# EAGLE design v1 (EAGLE 7.6.0)
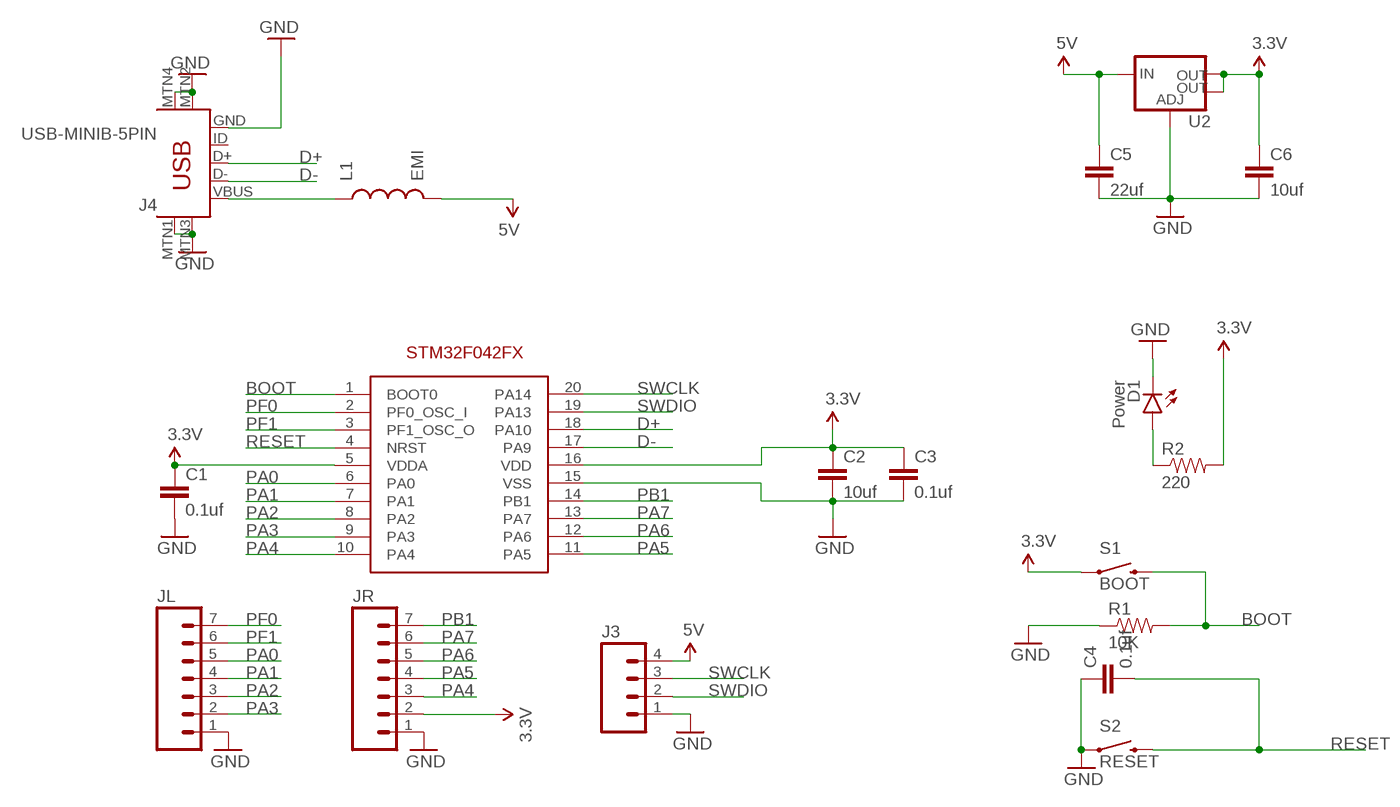
[diagram p0: schematic, sheet 1]

## Parts
C1  0.1uf  CAP0805  [0805]
C2  10uf  CAP0805  [0805]
C3  0.1uf  CAP0805  [0805]
C4  0.1uf  CAP0805  [0805]
C5  22uf  CAP0805  [0805]
C6  10uf  CAP0805  [0805]
D1  Power  LED1206  [LED-1206]
J3  M04NO_SILK_ALL_ROUND  [1X04_NO_SILK_ALL_ROUND]
J4  USB-MINIB-5PIN  [USB-MINIB]
JL  M07NO_SILK  [1X07_NO_SILK]
JR  M07NO_SILK  [1X07_NO_SILK]
L1  EMI  INDUCTOR0805  [0805]
R1  10K  RESISTOR0805-RES  [0805]
R2  220  RESISTOR0805-RES  [0805]
S1  BOOT  SWITCH-MOMENTARY-2SMD-1101NE  [TACTILE-SWITCH-1101NE]
S2  RESET  SWITCH-MOMENTARY-2SMD-1101NE  [TACTILE-SWITCH-1101NE]
U1  STM32F042FX  [TSSOP20]
U2  V_REG_LM1117SOT223  [SOT223]

## Nets
3.3V: C1.1 C2.1 C3.1 C6.1 JR.2 R2.2 S1.1 U1.5(VDDA) U1.16(VDD) U2.2(OUT) U2.4(OUT)
5V: C5.1 J3.4 L1.2 U2.3(IN)
BOOT: R1.2 S1.2 U1.1(BOOT0)
D+: J4.D+ U1.18(PA10)
D-: J4.D- U1.17(PA9)
GND: C1.2 C2.2 C3.2 C4.1 C5.2 C6.2 D1.C J3.1 J4.GND J4.MTN1(MTN2) J4.MTN2(MTN3) J4.MTN3(MTN1) J4.MTN4 JL.1 JR.1 R1.1 S2.1 U1.15(VSS) U2.1(ADJ)
N$2: D1.A R2.1
N$12: J4.VBUS L1.1
PA0: JL.5 U1.6(PA0)
PA1: JL.4 U1.7(PA1)
PA2: JL.3 U1.8(PA2)
PA3: JL.2 U1.9(PA3)
PA4: JR.3 U1.10(PA4)
PA5: JR.4 U1.11(PA5)
PA6: JR.5 U1.12(PA6)
PA7: JR.6 U1.13(PA7)
PB1: JR.7 U1.14(PB1)
PF0: JL.7 U1.2(PF0_OSC_I)
PF1: JL.6 U1.3(PF1_OSC_O)
RESET: C4.2 S2.2 U1.4(NRST)
SWCLK: J3.3 U1.20(PA14)
SWDIO: J3.2 U1.19(PA13)
Unconnected: J4.ID

## Library data of the parts
C1-C6 = SparkFun-Capacitors:CAP: Capacitor Standard 0603 ceramic capacitor, and 0.1" leaded capacitor.
D1 = SparkFun-LED:LED: LEDs Standard schematic elements and footprints for 5mm, 3mm, 1206, and 0603 sized LEDs. 5mm - Spark Fun Electronics SKU : COM-00529 (and others)
J3 = SparkFun-Connectors:M04: Header 4 Standard 4-pin 0.1" header. Use with straight break away headers (SKU : PRT-00116), right angle break away headers (PRT-00553), swiss pins (PRT-00743), machine pins (PRT-00117), and female headers (PRT-00115). Molex polarized connector foot print use with SKU : PRT-08231 with associated crimp pins and housings. 1MM SMD Version SKU: PRT-10208; PROD_ID: CONN-09696
J4 = SparkFun-Connectors:USB-MINIB: Mini-USB "B" connector with 5th pin broken out. Created new symbol breaking out 5th "ID" pin in mini/micro USB connector spec. See: http://en.wikipedia.org/wiki/Mini_usb#Cables. Uses same footprint as 4-pin symbol. Also added pins to connect to mounting / shield pads if required (probably not generally needed as signals aren't shielded once they leave the connector).; PROD_ID: CONN-08193
JL JR = SparkFun-Connectors:M07: Header 7 Standard 7-pin 0.1" header. Use with straight break away headers (SKU : PRT-00116), right angle break away headers (PRT-00553), swiss pins (PRT-00743), machine pins (PRT-00117), and female headers (PRT-00115). NOTES ON THE VARIANTS LOCK and LOCK_LONGPADS... This footprint was designed to help hold the alignment of a through-hole component (i.e. 7-pin header) while soldering it into place. You may notice that each hole has been shifted either up or down by 0.005 of an inch from it's more standard position (which is usually a perfectly straight line). This slight alteration caused the pins (the squares in the middle) to touch the edges of the holes. Because they are alternating, it causes a "brace" to hold the header in place. 0.005 has proven to be the perfect amount of "off-center" position when using our standard breakaway headers. Although looks a little odd when you look at the bare footprint, once you have a header in there, the alteration is very hard to notice. Also, if you push a header all the way into place, it is covered up entirely on the bottom side. This idea of altering the position of holes to aid alignment will be further integrated into the Sparkfun Library for other footprints. It can help hold any component with 3 or more connection pins.
L1 = SparkFun-Passives:INDUCTOR: Inductors Basic Inductor/Choke - 0603 and 1206. Footprints are not proven and vary greatly between part numbers. INDUCTOR POWER 3.3UH 4.0A SMD 0.197" L x 0.197" W x 0.177" H (5.00mm x 5.00mm x 4.50mm)
R1 R2 = SparkFun-Resistors:RESISTOR: Resistor Basic schematic elements and footprints for 0603, 1206, and PTH resistors.
S1 S2 = SparkFun-Electromechanical:SWITCH-MOMENTARY-2: Various NO switches- pushbuttons, reed, etc; PROD_ID: SWCH-00815
U1 = STM32F042Fx:STM32F042FX: STM32F042Fx microcontroller
U2 = SparkFun-PowerIC:V_REG_LM1117: Voltage Regulator LM1117 Standard adjustable voltage regulator but in SMD form. Spark Fun Electronics SKU : COM-00595; PROD_ID: VREG-08170

## Board
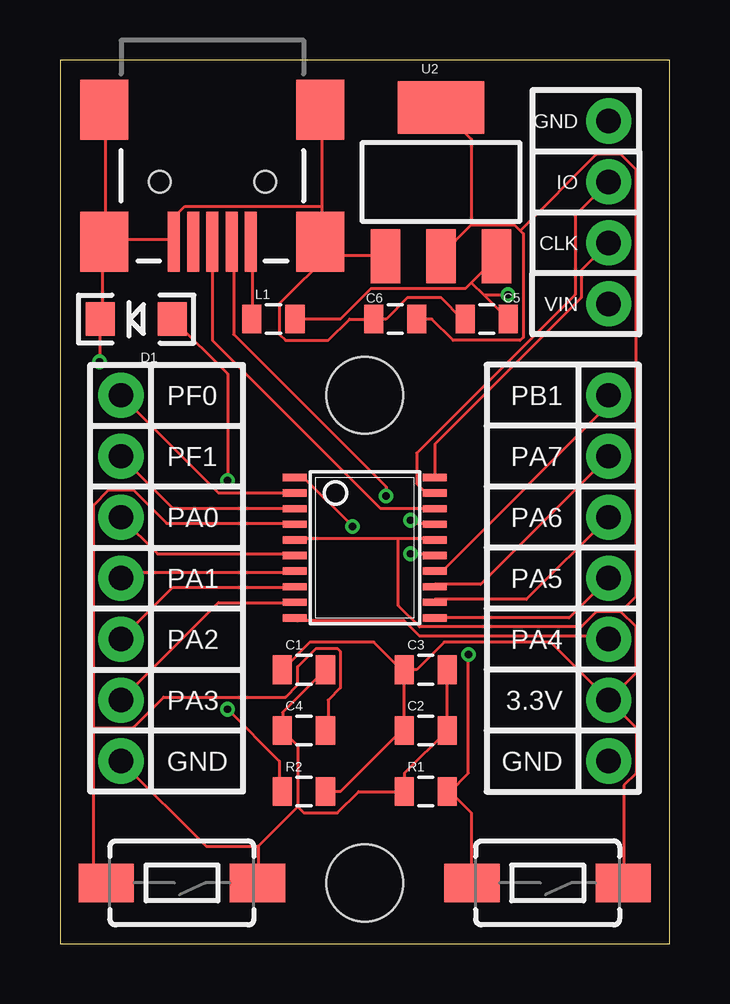
[diagram p1: board, top side]
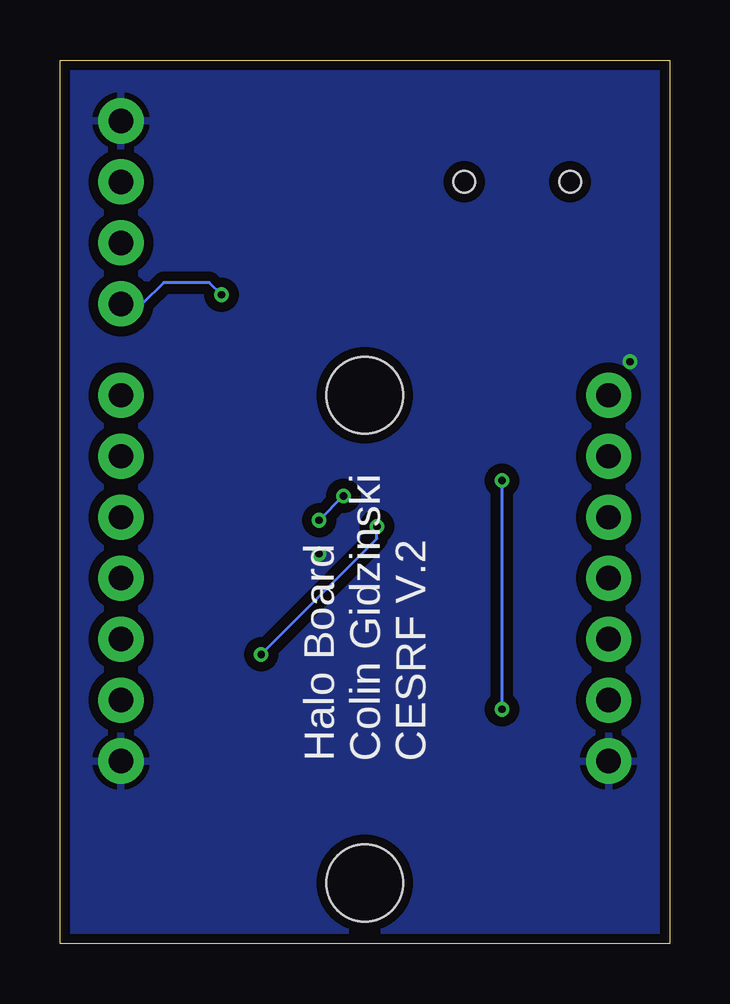
[diagram p2: board, bottom side, seen from below]

Size 25.4 x 36.83 mm. Coordinates in mm from the lower left corner, seen from the top.
Outline: 0,36.83 0,0 25.4,0 25.4,36.83 0,36.83
Copper layers (1*16): Top 0.035mm / dielectric 1.5mm / Bottom 0.035mm
Design rules "dirt_cheap_dirty_boards.v1": minimum track width 5mil, minimum drill 12mil, track to track 5mil, track to pad 5mil, pad to pad 5mil, via to via 5mil, smd to smd 0mil, copper to edge 10mil, drill to drill 10mil, minimum pad ring 10mil, minimum via ring 6mil, stop-mask expansion 2mil, vias tented up to drill 25mil, thermal gap 10mil
Holes 3.2 mm at 12.7,2.54 12.7,22.86

### Footprints (pad centres in the part's own frame; a part is rotated, then mirrored left to right if it is on the bottom)
0805 = smd 0.8 x 1.2: 1 -0.9,0; 2 0.9,0
LED-1206 = smd 1.2 x 1.4: A -1.5,0; C 1.5,0
1X04_NO_SILK_ALL_ROUND = drill 1.016 pad 1.88: 1 0,0; 2 2.54,0; 3 5.08,0; 4 7.62,0
USB-MINIB = smd 2.5 x 0.5: D+ 2.5,0; D- 2.5,0.8; GND 2.5,-1.6; ID 2.5,-0.8; VBUS 2.5,1.6 | smd 2.5 x 2: MTN1 -3,4.5; MTN2 2.5,4.5; MTN3 -3,-4.5; MTN4 2.5,-4.5 | hole 0.9: 0,2.2; 0,-2.2
1X07_NO_SILK = drill 1.016 pad 1.88: 1 0,0; 2 2.54,0; 3 5.08,0; 4 7.62,0; 5 10.16,0; 6 12.7,0; 7 15.24,0
TACTILE-SWITCH-1101NE = smd 2.3 x 1.6: 1 -3.15,0; 2 3.15,0
TSSOP20 = smd 0.305 x 0.991: 1 -2.925,-2.918; 2 -2.275,-2.918; 3 -1.625,-2.918; 4 -0.975,-2.918; 5 -0.325,-2.918; 6 0.325,-2.918; 7 0.975,-2.918; 8 1.625,-2.918; 9 2.275,-2.918; 10 2.925,-2.918; 11 2.925,2.918; 12 2.275,2.918; 13 1.625,2.918; 14 0.975,2.918; 15 0.325,2.918; 16 -0.325,2.918; 17 -0.975,2.918; 18 -1.625,2.918; 19 -2.275,2.918; 20 -2.925,2.918
SOT223 = smd 1.219 x 2.235: 1 -2.311,-3.099; 2 0,-3.099; 3 2.311,-3.099 | smd 3.6 x 2.2: 4 0,3.099

### Placement (x,y rotation side)
C1  10.16,11.43 0 top
C2  15.24,8.89 0 top
C3  15.24,11.43 0 top
C4  10.16,8.89 0 top
C5  17.78,26.04 180 top
C6  13.97,26.04 180 top
D1  3.18,26.04 180 top
J3  22.86,34.29 270 top
J4  6.35,31.75 270 top
JL  2.54,7.62 90 top
JR  22.86,7.62 90 top
L1  8.89,26.04 0 top
R1  15.24,6.35 0 top
R2  10.16,6.35 0 top
S1  20.32,2.54 180 top
S2  5.08,2.54 180 top
U1  12.7,16.51 270 top
U2  15.88,31.75 0 top

### Tracks (layer width: path | path; a pad name or v marks a point on that pad's centre or on a via)
3.3V
  Top 0.127: C6.1 15.49,26.04 16.38,25.15 19.18,25.15 19.3,25.27 19.3,29.59 19.18,29.72 | 19.18,29.72 18.92,29.97 17.14,29.97 | 17.14,29.97 15.88,28.7 U2.2 | 17.14,29.97 17.14,33.53 15.88,34.8 U2.4 | C1.1 10.41,12.57 13.08,12.57 14.22,11.43 C3.1 | R2.2 11.68,6.35 14.22,8.89 C2.1 C3.1 | 14.1,16.89 15.49,16.89 U1.16 | 14.1,16.89 9.91,16.89 U1.5 | JR.2 24,9.02 24,7.11 23.5,6.6 23.5,2.54 S1.1 | 14.1,16.89 14.1,14.1 14.99,13.21 21.72,13.21 22.35,13.84 23.37,13.84 | 23.37,13.84 24,13.21 24,11.3 JR.2 | C3.1 14.86,11.43 16,12.57 20.45,12.57 JR.2 | 19.18,29.72 22.35,32.89 23.37,32.89 24,32.26 24,14.48 23.37,13.84
5V  (via drill 0.3)
  Top 0.127: L1.2 11.68,26.04 12.95,27.3 16.89,27.3 17.14,27.56 | 17.14,27.56 18.16,28.57 U2.3 | 17.14,27.56 17.65,27.05 | 17.65,27.05 C5.1 | 17.65,27.05 v18.67,27.05
  Bottom 0.127: J3.4 21.97,26.67 21.08,27.56 19.18,27.56 v18.67,27.05
BOOT  (via drill 0.3)
  Top 0.127: v12.19,17.4 10.16,19.43 9.91,19.43 U1.1 | v17.02,12.07 17.02,7.11 16.26,6.35 | 16.26,6.35 17.14,5.46 17.14,2.54 S1.2 | 16.26,6.35 R1.2
  Bottom 0.127: v12.19,17.4 12.19,16.89 v17.02,12.07
D+
  Top 0.127: J4.D+ 6.35,25.15 13.33,18.16 15.49,18.16 U1.18
D-  (via drill 0.3)
  Top 0.127: v14.6,17.65 14.73,17.53 15.49,17.53 U1.17 | v13.59,18.67 13.59,19.05 7.24,25.4 7.24,29.21 J4.D-
  Bottom 0.127: v13.59,18.67 v14.6,17.65
GND  (via drill 0.3)
  Top 0.127: C2.2 14.35,7.11 R1.1 12.45,6.35 11.56,5.46 10.16,5.46 9.91,5.72 | C2.2 C3.2 | C2.2 | C4.1 9.27,9.65 C1.2 | 8.25,4.06 8.25,2.54 S2.1 | 9.91,5.72 8.25,4.06 | 9.91,5.72 9.91,8.26 C4.1 | C4.1 | C5.2 16.76,26.04 15.88,26.92 14.48,26.92 13.59,26.04 C6.2 12.06,26.04 11.18,25.15 9.4,25.15 9.14,25.4 9.14,26.67 11.3,28.83 | 11.3,28.83 10.92,29.21 J4.MTN2 | 11.3,28.83 11.43,28.7 13.46,28.7 U2.1 | 11.3,28.83 J4.MTN2 | 10.92,30.73 10.92,29.34 J4.MTN2 | 10.92,30.73 10.92,34.67 J4.MTN1 | 1.91,29.34 4.7,29.34 J4.GND 4.83,29.34 4.83,30.35 5.21,30.73 10.92,30.73 | 1.91,29.34 1.91,34.67 J4.MTN3 | 1.91,29.34 J4.MTN4 1.78,29.21 1.78,26.04 D1.C 1.65,26.04 v1.65,24.26 | v14.6,16.26 15.49,16.26 U1.15 | 8.25,4.06 6.1,4.06 JL.1
  pour Bottom (isolate 0.406): 0,36.83 0,0 25.4,0 25.4,36.83
N$2  (via drill 0.3)
  Top 0.127: v6.98,9.78 9.14,7.62 9.14,6.35 R2.1 | v6.98,19.3 6.98,23.75 4.7,26.04 D1.A
  Bottom 0.127: v6.98,19.3 v6.98,9.78
N$12
  Top 0.127: L1.1 8,29.21 J4.VBUS
PA0
  Top 0.127: JL.5 4.06,16.26 9.78,16.26 U1.6
PA1
  Top 0.127: JL.4 2.79,15.49 9.78,15.49 U1.7
PA2
  Top 0.127: JL.3 4.7,14.86 9.78,14.86 U1.8
PA3
  Top 0.127: JL.2 6.6,14.22 9.78,14.22 U1.9
PA4
  Top 0.127: JR.3 22.73,12.83 14.99,12.83 14.35,13.46 9.91,13.46 U1.10
PA5
  Top 0.127: JR.4 21.21,13.59 U1.11
PA6
  Top 0.127: JR.5 19.43,14.35 15.62,14.35 U1.12
PA7
  Top 0.127: JR.6 17.53,14.99 15.62,14.99 U1.13
PB1
  Top 0.127: JR.7 22.86,22.48 16,15.62 15.62,15.62 U1.14
PF0
  Top 0.127: JL.7 6.6,18.8 U1.2
PF1
  Top 0.127: JL.6 4.7,18.16 9.78,18.16 U1.3
RESET
  Top 0.127: 1.4,9.02 1.4,3.05 1.91,2.54 S2.2 | 1.4,9.02 1.4,18.29 2.03,18.92 3.05,18.92 4.45,17.53 9.78,17.53 U1.4 | 1.4,9.02 3.05,9.02 4.32,10.29 9.4,10.29 9.91,10.8 9.91,11.56 10.67,12.32 11.56,12.32 11.68,12.19 11.68,10.67 11.18,10.16 11.18,8.89 C4.2
SWCLK
  Top 0.127: J3.3 21.72,28.07 21.72,26.92 15.62,20.83 15.62,19.56 U1.20
SWDIO
  Top 0.127: J3.2 21.46,30.35 21.46,27.05 14.86,20.45 14.86,19.18 15.24,18.8 15.49,18.8 U1.19

### Text on the board
tNames: GND | IO | CLK | VIN | PF0 | PB1 | PF1 | PA7 | PA0 | PA6 | PA1 | PA5 | PA2 | PA4 | PA3 | 3.3V | GND | GND
bNames: Halo Board / Colin Gidzinski / CESRF V.2